# Altium project ControllerBoard.PrjPcb
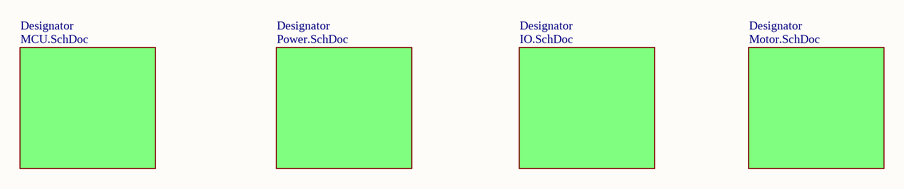
[diagram p0: main.SchDoc]
5 sheets, 155 parts. Net scope: global (net labels, ports and power ports of the same name join across sheets).
Board file: ControllerBoard.PcbDoc
Sheets:
  main.SchDoc
    Designator = MCU.SchDoc
    Designator = Power.SchDoc
    Designator = IO.SchDoc
    Designator = Motor.SchDoc

## Sheet main.SchDoc
size A4

### Sub-sheets
Designator = MCU.SchDoc: no entries
Designator = Power.SchDoc: no entries
Designator = IO.SchDoc: no entries
Designator = Motor.SchDoc: no entries

## Sheet MCU.SchDoc
size A4
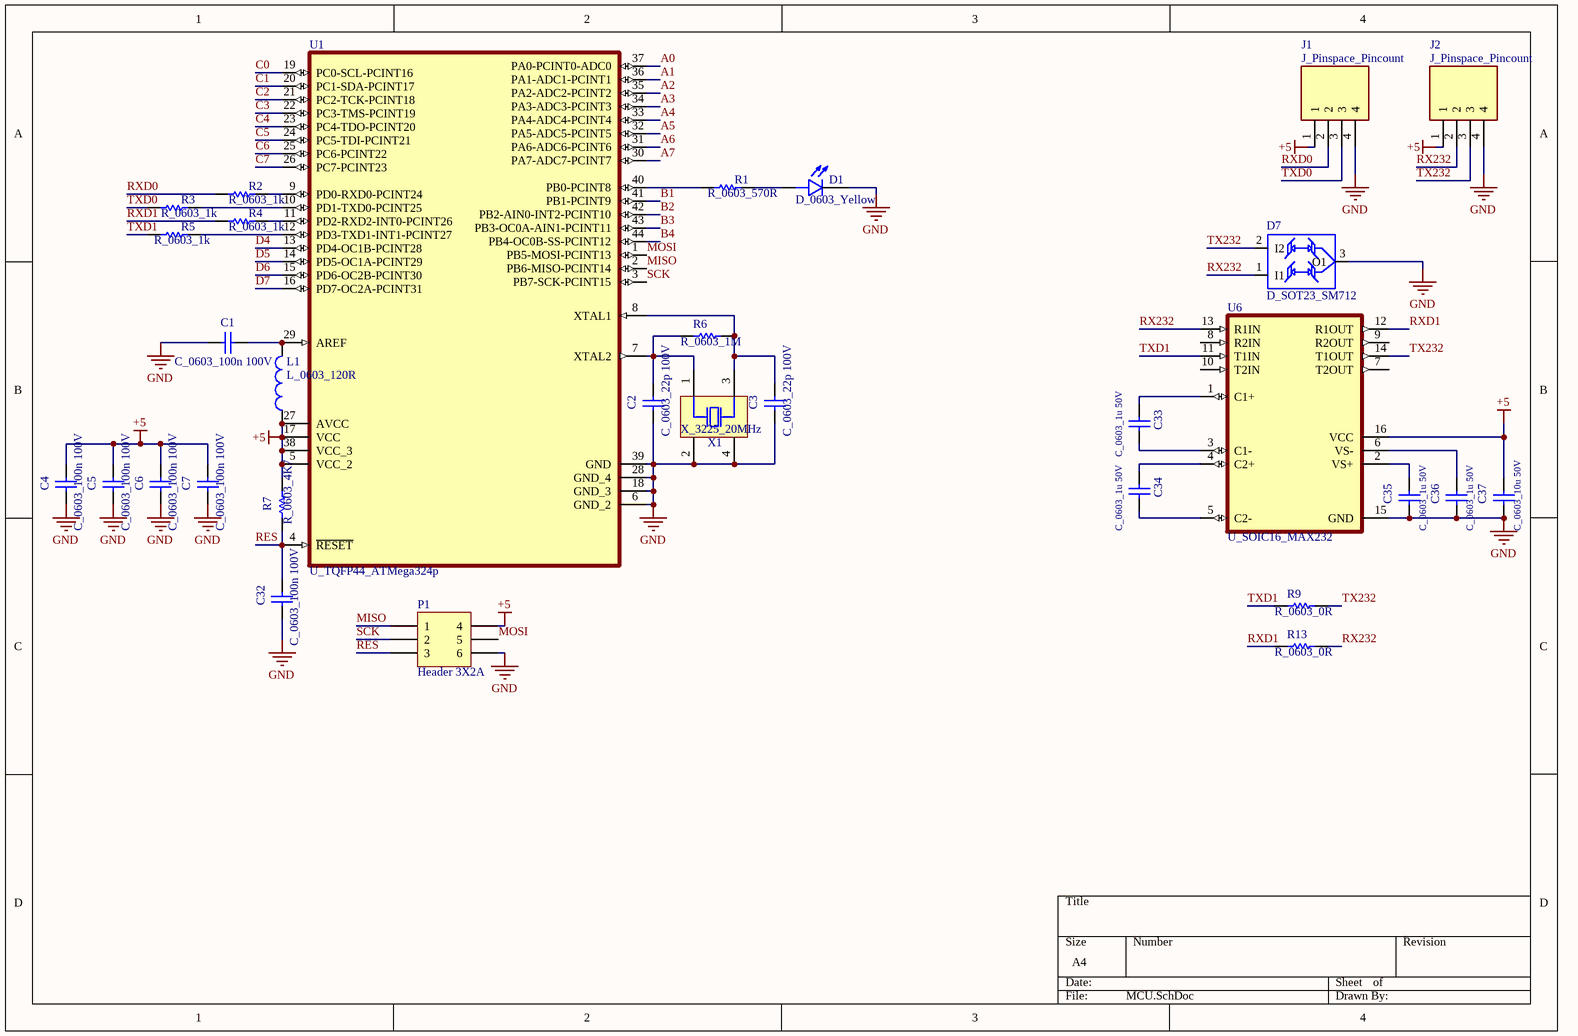
[diagram p1: MCU.SchDoc]

### Parts
C1  C_0603_100n 100V  [CAP 0603]
C2  C_0603_22p 100V  [CAP 0603]
C3  C_0603_22p 100V  [CAP 0603]
C4  C_0603_100n 100V  [CAP 0603]
C5  C_0603_100n 100V  [CAP 0603]
C6  C_0603_100n 100V  [CAP 0603]
C7  C_0603_100n 100V  [CAP 0603]
C32  C_0603_100n 100V  [CAP 0603]
C33  C_0603_1u 50V  [CAP 0603]
C34  C_0603_1u 50V  [CAP 0603]
C35  C_0603_1u 50V  [CAP 0603]
C36  C_0603_1u 50V  [CAP 0603]
C37  C_0603_10u 50V  [CAP 0603]
D1  D_0603_Yellow  [Led 0603]
D7  D_SOT23_SM712  [SOT23]
J1  J_Pinspace_Pincount  [4 Pin PCB STB 5.08]
J2  J_Pinspace_Pincount  [4 Pin PCB STB 5.08]
L1  L_0603_120R  [Inductor 0603]
P1  Header 3X2A  [HDR2X3_CEN]
R1  R_0603_570R  [RES 0603]
R2  R_0603_1k  [RES 0603]
R3  R_0603_1k  [RES 0603]
R4  R_0603_1k  [RES 0603]
R5  R_0603_1k  [RES 0603]
R6  R_0603_1M  [RES 0603]
R7  R_0603_4K7  [RES 0603]
R9  R_0603_0R  [RES 0603]
R13  R_0603_0R  [RES 0603]
U1  U_TQFP44_ATMega324p  [TQFP44]
U6  U_SOIC16_MAX232  [SOIC16]
X1  X_3225_20MHz  [Crystal 3.2x2.5]

### Nets
+5: C4.2 C5.2 C6.2 C7.2 C37.2 J1.1 J2.1 L1.1 P1.4 R7.2 U1.5(VCC_2) U1.17(VCC) U1.27(AVCC) U1.38(VCC_3) U6.16(VCC)
GND: C1.1 C2.2 C3.2 C4.1 C5.1 C6.1 C7.1 C32.1 C35.1 C36.1 C37.1 D1.2(C) D7.3(O1) J1.4 J2.4 P1.6 U1.6(GND_2) U1.18(GND_3) U1.28(GND_4) U1.39(GND) U6.15(GND) X1.2(NC) X1.4(NC)
A0: U1.37(PA0-PCINT0-ADC0)
A1: U1.36(PA1-ADC1-PCINT1)
A2: U1.35(PA2-ADC2-PCINT2)
A3: U1.34(PA3-ADC3-PCINT3)
A4: U1.33(PA4-ADC4-PCINT4)
A5: U1.32(PA5-ADC5-PCINT5)
A6: U1.31(PA6-ADC6-PCINT6)
A7: U1.30(PA7-ADC7-PCINT7)
B1: U1.41(PB1-PCINT9)
B2: U1.42(PB2-AIN0-INT2-PCINT10)
B3: U1.43(PB3-OC0A-AIN1-PCINT11)
B4: U1.44(PB4-OC0B-SS-PCINT12)
C0: U1.19(PC0-SCL-PCINT16)
C1: U1.20(PC1-SDA-PCINT17)
C2: U1.21(PC2-TCK-PCINT18)
C3: U1.22(PC3-TMS-PCINT19)
C4: U1.23(PC4-TDO-PCINT20)
C5: U1.24(PC5-TDI-PCINT21)
C6: U1.25(PC6-PCINT22)
C7: U1.26(PC7-PCINT23)
D4: U1.13(PD4-OC1B-PCINT28)
D5: U1.14(PD5-OC1A-PCINT29)
D6: U1.15(PD6-OC2B-PCINT30)
D7: U1.16(PD7-OC2A-PCINT31)
MISO: P1.1 U1.2(PB6-MISO-PCINT14)
MOSI: P1.5 U1.1(PB5-MOSI-PCINT13)
RES: C32.2 P1.3 R7.1 U1.4(~{RESET})
RX232: D7.1(I1) J2.2 R13.2 U6.13(R1IN)
RXD0: J1.2 R2.2
RXD1: R4.2 R13.1 U6.12(R1OUT)
SCK: P1.2 U1.3(PB7-SCK-PCINT15)
TX232: D7.2(I2) J2.3 R9.2 U6.14(T1OUT)
TXD0: J1.3 R3.2
TXD1: R5.2 R9.1 U6.11(T1IN)
NetC1_2: C1.2 L1.2 U1.29(AREF)
NetC2_1: C2.1 R6.1 U1.7(XTAL2) X1.1(OSC1)
NetC3_1: C3.1 R6.2 U1.8(XTAL1) X1.3(OSC2)
NetC33_1: C33.1 U6.1(C1+)
NetC33_2: C33.2 U6.3(C1-)
NetC34_1: C34.1 U6.4(C2+)
NetC34_2: C34.2 U6.5(C2-)
NetC35_2: C35.2 U6.2(VS+)
NetC36_2: C36.2 U6.6(VS-)
NetD1_1: D1.1(A) R1.1
NetR1_2: R1.2 U1.40(PB0-PCINT8)
NetR2_1: R2.1 U1.9(PD0-RXD0-PCINT24)
NetR3_1: R3.1 U1.10(PD1-TXD0-PCINT25)
NetR4_1: R4.1 U1.11(PD2-RXD2-INT0-PCINT26)
NetR5_1: R5.1 U1.12(PD3-TXD1-INT1-PCINT27)

Not connected (* = marked no-connect by the designer): U6 7(T2OUT) 8(R2IN) 9(R2OUT) 10(T2IN)

### Library data of the parts
C1-C7 C32-C37 = Cap: Capacitor; Published: 8-Jun-2000; LatestRevisionDate: 17-Jul-2002; LatestRevisionNote: Re-released for DXP Platform.; Publisher: Altium Limited
D1 = Led: MP: SML-D12FWT86; MF: Rohm; Price: None; Availability: In Stock; Package: 0603 Rohm; SnapEDA_Link: https://www.snapeda.com/parts/SML-D12FWT86/Rohm/view-part/?ref=snap; Check_prices: https://www.snapeda.com/parts/SML-D12FWT86/Rohm/view-part/?ref=eda; Value: *; Purchase-URL: https://pricing.snapeda.com/search/part/SML-D12FWT86/?ref=eda
D7 = DIODE TVS ARRAY: TVS Diode Array; MP: SM712; MF: Semtech; Price: None; SnapEDA_Link: https://www.snapeda.com/parts/SM712/Semtech/view-part/4219095/?ref=snap; Availability: Unavailable; Value: *; Package: SOT-23 Semtech
J1 J2 = 4 Pin PCB Terminal Block: MP: TBP02R1-381-04BE; Availability: Unavailable; Package: None; Price: None; Value: *
L1 = Inductor: PCB_Layout: Complies with manufacturer's recommendation.; Published: 26-Sep-2008; DatasheetVersion: Mar-2008; PackageVersion: Mar-2008; PackageReference: B82462G4; Publisher: Altium Limited; PackageDescription: SM Power Inductor; 2 Leads; Body 6.3 x 6.3 x 3.0 mm (LxWxH); ComponentLink1Description: Manufacturer Link; ComponentLink1URL: http://www.epcos.com/; ComponentLink2Description: Datasheet; ComponentLink2URL: http://www.epcos.com/inf/30/db/ind_2008/b82462g4.pdf
P1 = Header 3X2A: Header, 3-Pin, Dual row; LatestRevisionDate: 17-Jul-2002; LatestRevisionNote: Re-released for DXP Platform.; Publisher: Altium Limited
R1-R7 R9 R13 = Res: Resistor; Published: 8-Jun-2000; LatestRevisionDate: 17-Jul-2002; LatestRevisionNote: Re-released for DXP Platform.; Publisher: Altium Limited
U1 = ATMEGA324P-20AU: AVR AVRÂ® ATmega Microcontroller IC 8-Bit 20MHz 32KB _16K x 16_ FLASH 44-TQFP _10x10_; MF: Microchip; Availability: Unavailable; Package: TQFP-44 Microchip; Price: None; SnapEDA_Link: https://www.snapeda.com/parts/ATMEGA324P-20AU/Microchip/view-part/696895/?ref=snap; Value: *; MP: ATMEGA324P-20AU
U6 = MAX232DW: Dual EIA-232 driver and receiver 16-SOIC 0 to 70; MF: Texas Instruments; Price: None; SnapEDA_Link: https://www.snapeda.com/parts/MAX232DW/Texas%20Instruments/view-part/7702/?ref=snap; Purchase-URL: https://pricing.snapeda.com/search/part/MAX232DW/?ref=eda; Check_prices: https://www.snapeda.com/parts/MAX232DW/Texas%20Instruments/view-part/7702/?ref=eda; Value: *; MP: MAX232DW; Package: SOIC-16 Texas Instruments; Availability: Good
X1 = Crystal 4 Pin

## Sheet Power.SchDoc
size A4
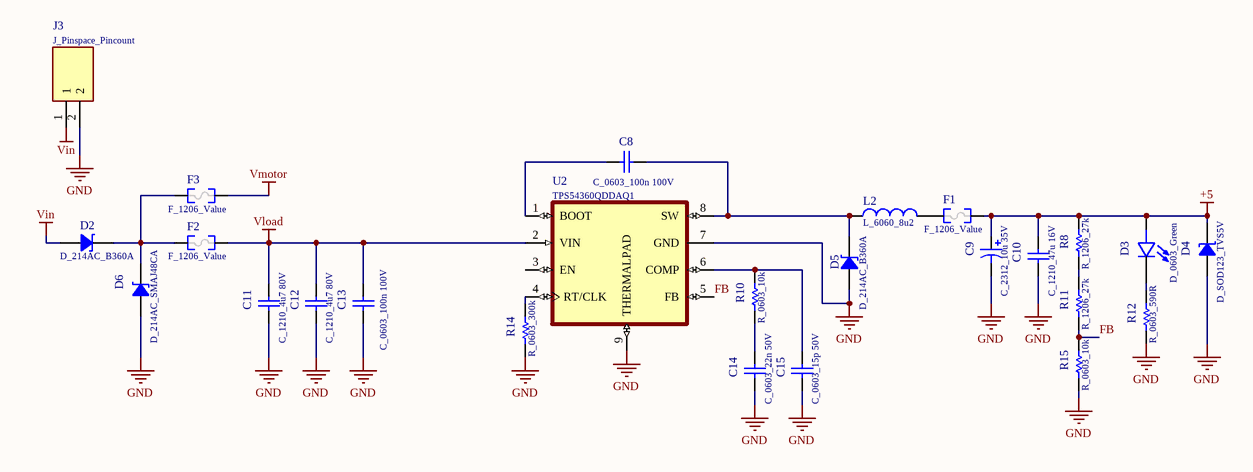
[diagram p2: Power.SchDoc]

### Parts
C8  C_0603_100n 100V  [CAP 0603]
C9  C_2312_10u 35V  [CAP 2312 TAN]
C10  C_1210_47u 16V  [CAP 1210]
C11  C_1210_4u7 80V  [CAP 1210]
C12  C_1210_4u7 80V  [CAP 1210]
C13  C_0603_100n 100V  [CAP 0603]
C14  C_0603_22n 50V  [CAP 0603]
C15  C_0603_15p 50V  [CAP 0603]
D2  D_214AC_B360A  [DO214AC SMA]
D3  D_0603_Green  [Led 0603]
D4  D_SOD123_TVS5V  [SOD-123]
D5  D_214AC_B360A  [DO214AC SMA]
D6  D_214AC_SMAJ48CA  [DO214AC SMA]
F1  F_1206_Value  [FUSE 1206_3216 0.6MM]
F2  F_1206_Value  [FUSE 1206_3216 0.6MM]
F3  F_1206_Value  [FUSE 1206_3216 0.6MM]
J3  J_Pinspace_Pincount  [2 Pin PCB STB 5.08]
L2  L_6060_8u2  [Inductor 6060]
R8  R_1206_27k  [RES 1206]
R10  R_0603_10k  [RES 0603]
R11  R_1206_27k  [RES 1206]
R12  R_0603_590R  [RES 0603]
R14  R_0603_300k  [RES 0603]
R15  R_0603_10k  [RES 1206]
U2  TPS54360QDDAQ1  [SOIC8]

### Nets
+5: C9.1 C10.1 D3.1(A) D4.2 F1.2 R8.2
GND: C9.2 C10.2 C11.2 C12.2 C13.2 C14.2 C15.2 D4.1 D5.1 D6.1 J3.2 R12.1 R14.1 R15.1 U2.7(GND) U2.9(THERMALPAD)
Vin: D2.1 J3.1
Vload: C11.1 C12.1 C13.1 F2.2 U2.2(VIN)
Vmotor: F3.2
FB: R11.1 R15.2 U2.5(FB)
NetC8_1: C8.1 D5.2 L2.1 U2.8(SW)
NetC8_2: C8.2 U2.1(BOOT)
NetC14_1: C14.1 R10.1
NetC15_1: C15.1 R10.2 U2.6(COMP)
NetD2_2: D2.2 D6.2 F2.1 F3.1
NetD3_2: D3.2(C) R12.2
NetF1_1: F1.1 L2.2
NetR8_1: R8.1 R11.2
NetR14_2: R14.2 U2.4(RT/CLK)

Not connected (* = marked no-connect by the designer): U2 3(EN)

### Library data of the parts
C8 C10-C15 = Cap: Capacitor; Published: 8-Jun-2000; LatestRevisionDate: 17-Jul-2002; LatestRevisionNote: Re-released for DXP Platform.; Publisher: Altium Limited
C9 = Cap Tantalium: Capacitor Tantalium; Published: 8-Jun-2000; LatestRevisionDate: 17-Jul-2002; LatestRevisionNote: Re-released for DXP Platform.; Publisher: Altium Limited
D2 D5 D6 = Diode Zener: Zener Diode
D3 = Led: MP: SML-D12FWT86; MF: Rohm; Price: None; Availability: In Stock; Package: 0603 Rohm; SnapEDA_Link: https://www.snapeda.com/parts/SML-D12FWT86/Rohm/view-part/?ref=snap; Check_prices: https://www.snapeda.com/parts/SML-D12FWT86/Rohm/view-part/?ref=eda; Value: *; Purchase-URL: https://pricing.snapeda.com/search/part/SML-D12FWT86/?ref=eda
D4 = DIODE TVS UNI: Rectifier Diode
F1-F3 = Fuse
J3 = 2 Pin PCB Terminal Block: MF: CUI Devices; MP: TBP02R1-381-02BE; CUI_purchase_URL: https://www.cuidevices.com/product/interconnect/connectors/terminal-blocks/tbp02r1-381-series?utm_source=snapeda.com&utm_medium=referral&utm_campaign=snapedaBOM; Purchase-URL: https://pricing.snapeda.com/search/part/TBP02R1-381-02BE/?ref=eda; Price: None; SnapEDA_Link: https://www.snapeda.com/parts/TBP02R1-381-02BE/CUI+Devices/view-part/?ref=snap; Check_prices: https://www.snapeda.com/parts/TBP02R1-381-02BE/CUI+Devices/view-part/?ref=eda; Package: None; Availability: In Stock; Value: *
L2 = Inductor: as L1 on sheet MCU; Published: 26-Sep-2008; DatasheetVersion: Mar-2008; PackageVersion: Mar-2008; PackageReference: B82462G4; Publisher: Altium Limited; PackageDescription: SM Power Inductor; 2 Leads; Body 6.3 x 6.3 x 3.0 mm (LxWxH); ComponentLink1Description: Manufacturer Link; ComponentLink1URL: http://www.epcos.com/; ComponentLink2Description: Datasheet; ComponentLink2URL: http://www.epcos.com/inf/30/db/ind_2008/b82462g4.pdf
R8 R10-R12 R14 R15 = Res: Resistor; Published: 8-Jun-2000; LatestRevisionDate: 17-Jul-2002; LatestRevisionNote: Re-released for DXP Platform.; Publisher: Altium Limited
U2 = TPS54360QDDAQ1: Package: None; Price: None; Value: *; MP: TPS54360QDDAQ1; Availability: Unavailable

## Sheet IO.SchDoc
size A3
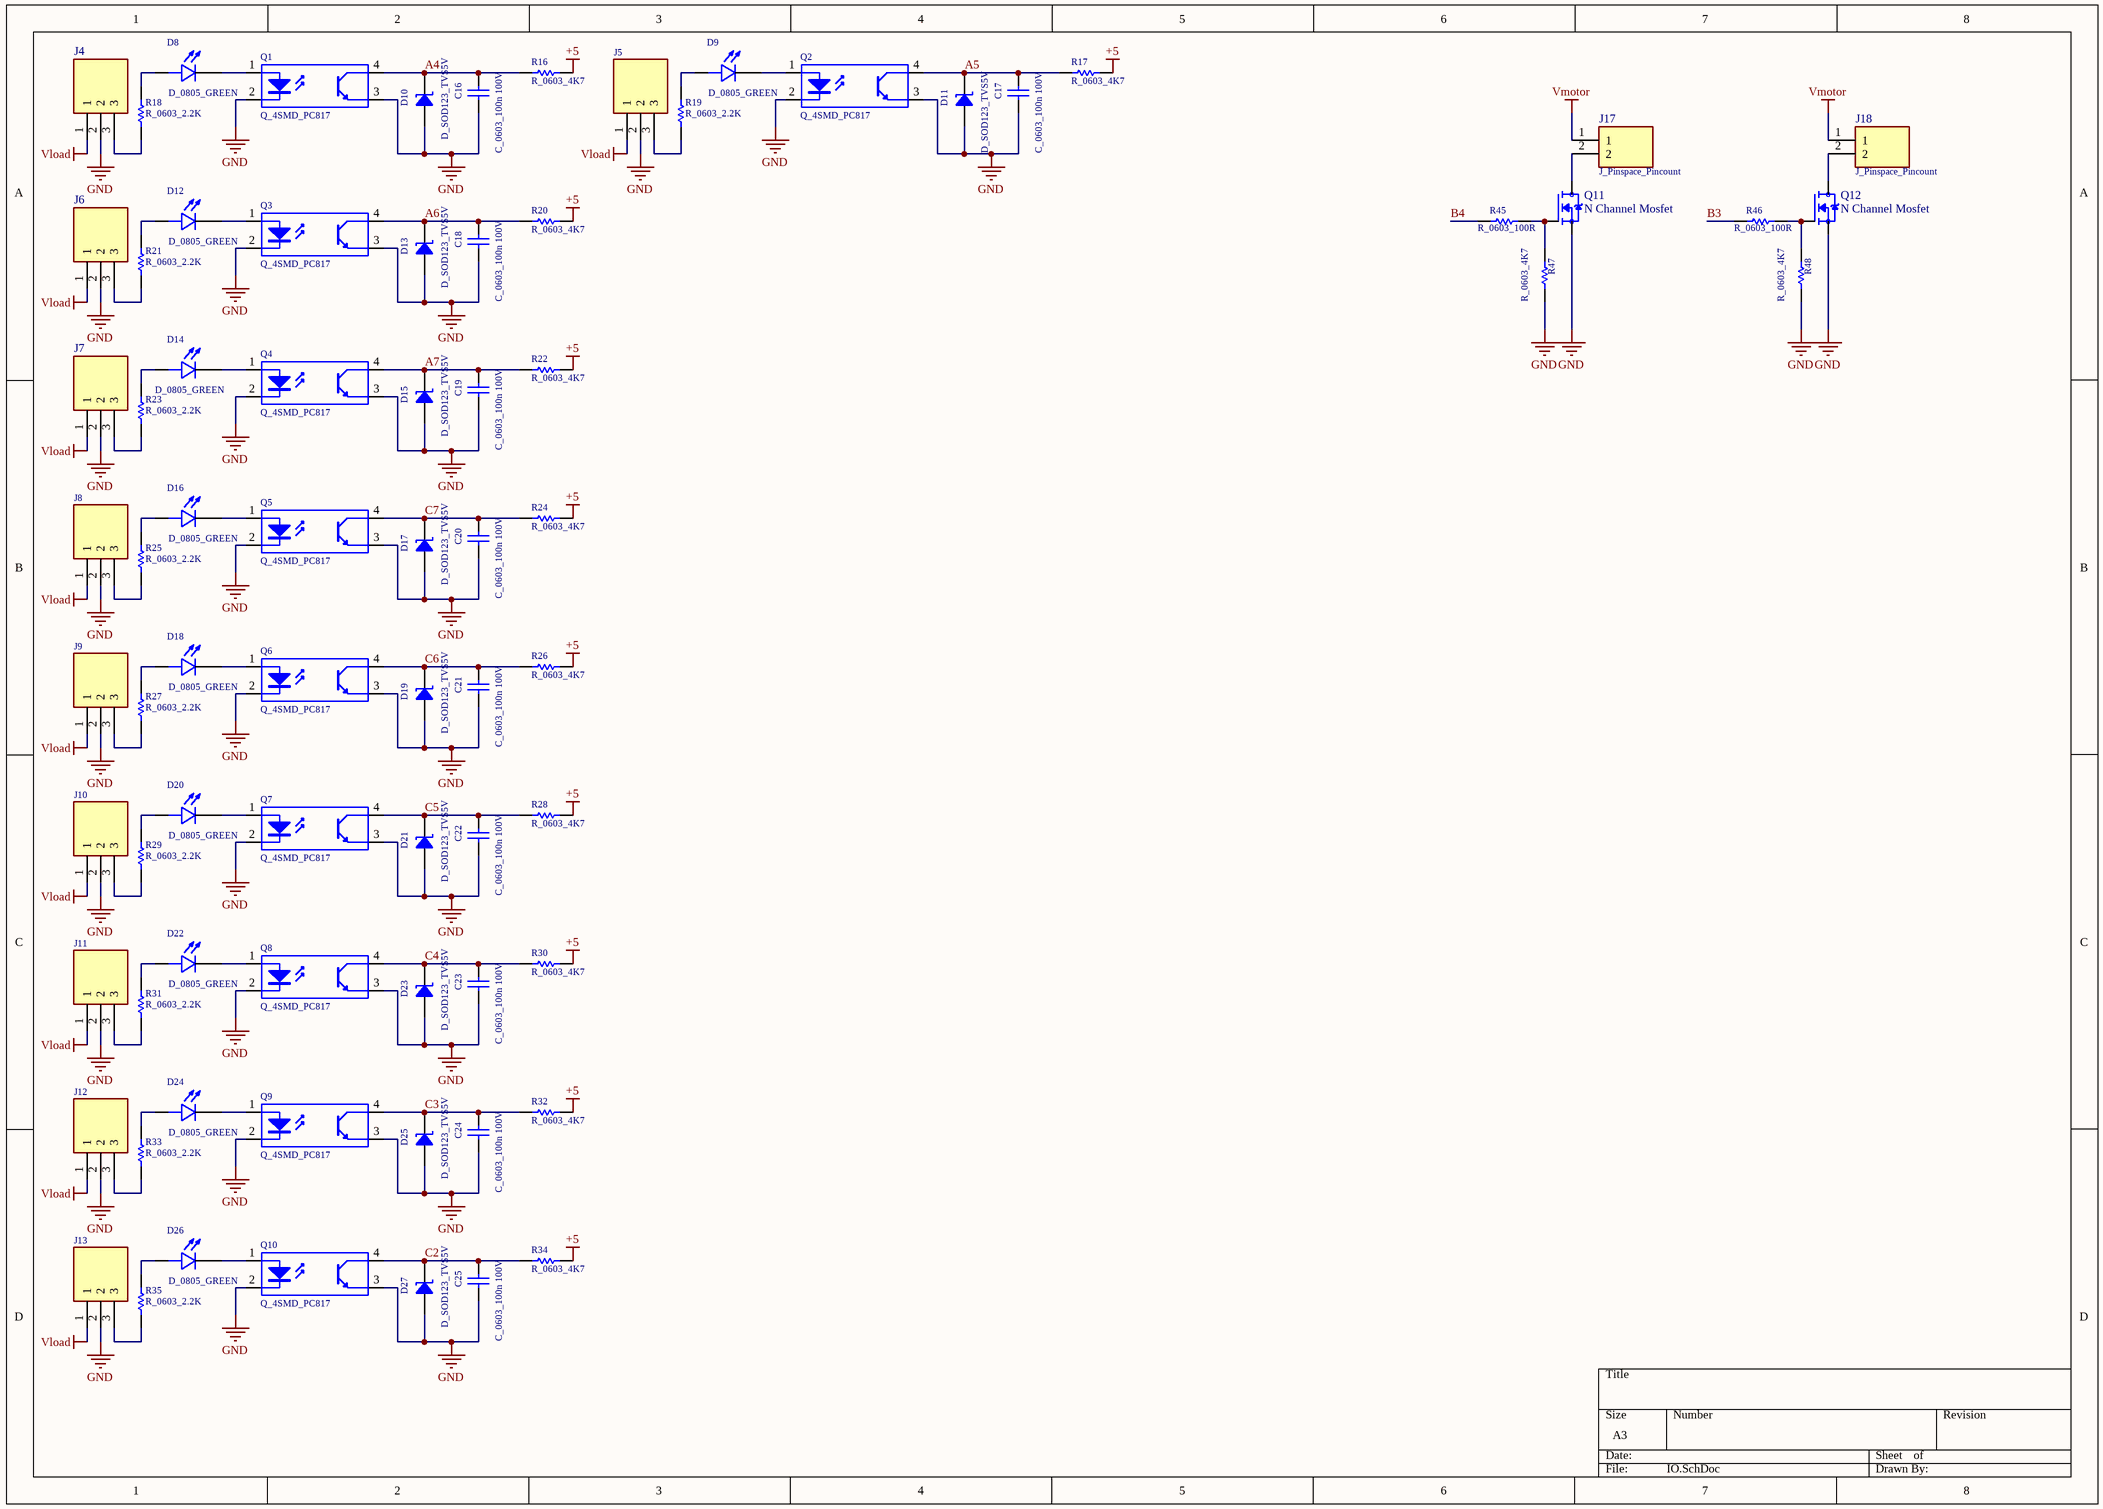
[diagram p3: IO.SchDoc]

### Parts
C16  C_0603_100n 100V  [CAP 1206]
C17  C_0603_100n 100V  [CAP 1206]
C18  C_0603_100n 100V  [CAP 1206]
C19  C_0603_100n 100V  [CAP 1206]
C20  C_0603_100n 100V  [CAP 1206]
C21  C_0603_100n 100V  [CAP 1206]
C22  C_0603_100n 100V  [CAP 1206]
C23  C_0603_100n 100V  [CAP 1206]
C24  C_0603_100n 100V  [CAP 1206]
C25  C_0603_100n 100V  [CAP 1206]
D8  D_0805_GREEN  [Led 0603]
D9  D_0805_GREEN  [Led 0603]
D10  D_SOD123_TVS5V  [SOD-123]
D11  D_SOD123_TVS5V  [SOD-123]
D12  D_0805_GREEN  [Led 0603]
D13  D_SOD123_TVS5V  [SOD-123]
D14  D_0805_GREEN  [Led 0603]
D15  D_SOD123_TVS5V  [SOD-123]
D16  D_0805_GREEN  [Led 0603]
D17  D_SOD123_TVS5V  [SOD-123]
D18  D_0805_GREEN  [Led 0603]
D19  D_SOD123_TVS5V  [SOD-123]
D20  D_0805_GREEN  [Led 0603]
D21  D_SOD123_TVS5V  [SOD-123]
D22  D_0805_GREEN  [Led 0603]
D23  D_SOD123_TVS5V  [SOD-123]
D24  D_0805_GREEN  [Led 0603]
D25  D_SOD123_TVS5V  [SOD-123]
D26  D_0805_GREEN  [Led 0603]
D27  D_SOD123_TVS5V  [SOD-123]
J4  J_Pinspace_Pincount  [3 Pin PCB STB 5.08]  (value not drawn)
J5  J_Pinspace_Pincount  [3 Pin PCB STB 5.08]  (value not drawn)
J6  J_Pinspace_Pincount  [3 Pin PCB STB 5.08]  (value not drawn)
J7  J_Pinspace_Pincount  [3 Pin PCB STB 5.08]  (value not drawn)
J8  J_Pinspace_Pincount  [3 Pin PCB STB 5.08]  (value not drawn)
J9  J_Pinspace_Pincount  [3 Pin PCB STB 5.08]  (value not drawn)
J10  J_Pinspace_Pincount  [3 Pin PCB STB 5.08]  (value not drawn)
J11  J_Pinspace_Pincount  [3 Pin PCB STB 5.08]  (value not drawn)
J12  J_Pinspace_Pincount  [3 Pin PCB STB 5.08]  (value not drawn)
J13  J_Pinspace_Pincount  [3 Pin PCB STB 5.08]  (value not drawn)
J17  J_Pinspace_Pincount  [2 Pin PCB STB 5.08]
J18  J_Pinspace_Pincount  [2 Pin PCB STB 5.08]
Q1  Q_4SMD_PC817  [4-SMD]
Q2  Q_4SMD_PC817  [4-SMD]
Q3  Q_4SMD_PC817  [4-SMD]
Q4  Q_4SMD_PC817  [4-SMD]
Q5  Q_4SMD_PC817  [4-SMD]
Q6  Q_4SMD_PC817  [4-SMD]
Q7  Q_4SMD_PC817  [4-SMD]
Q8  Q_4SMD_PC817  [4-SMD]
Q9  Q_4SMD_PC817  [4-SMD]
Q10  Q_4SMD_PC817  [4-SMD]
Q11  N Channel Mosfet  [TO-252]
Q12  N Channel Mosfet  [TO-252]
R16  R_0603_4K7  [RES 1206]
R17  R_0603_4K7  [RES 1206]
R18  R_0603_2.2K  [RES 1206]
R19  R_0603_2.2K  [RES 1206]
R20  R_0603_4K7  [RES 1206]
R21  R_0603_2.2K  [RES 1206]
R22  R_0603_4K7  [RES 1206]
R23  R_0603_2.2K  [RES 1206]
R24  R_0603_4K7  [RES 1206]
R25  R_0603_2.2K  [RES 1206]
R26  R_0603_4K7  [RES 1206]
R27  R_0603_2.2K  [RES 1206]
R28  R_0603_4K7  [RES 1206]
R29  R_0603_2.2K  [RES 1206]
R30  R_0603_4K7  [RES 1206]
R31  R_0603_2.2K  [RES 1206]
R32  R_0603_4K7  [RES 1206]
R33  R_0603_2.2K  [RES 1206]
R34  R_0603_4K7  [RES 1206]
R35  R_0603_2.2K  [RES 1206]
R45  R_0603_100R  [RES 1206]
R46  R_0603_100R  [RES 1206]
R47  R_0603_4K7  [RES 1206]
R48  R_0603_4K7  [RES 1206]

### Nets
+5: R16.1 R17.1 R20.1 R22.1 R24.1 R26.1 R28.1 R30.1 R32.1 R34.1
GND: C16.2 C17.2 C18.2 C19.2 C20.2 C21.2 C22.2 C23.2 C24.2 C25.2 D10.1 D11.1 D13.1 D15.1 D17.1 D19.1 D21.1 D23.1 D25.1 D27.1 J4.2 J5.2 J6.2 J7.2 J8.2 J9.2 J10.2 J11.2 J12.2 J13.2 Q1.2(K) Q1.3(E) Q2.2(K) Q2.3(E) Q3.2(K) Q3.3(E) Q4.2(K) Q4.3(E) Q5.2(K) Q5.3(E) Q6.2(K) Q6.3(E) Q7.2(K) Q7.3(E) Q8.2(K) Q8.3(E) Q9.2(K) Q9.3(E) Q10.2(K) Q10.3(E) Q11.3(S) Q12.3(S) R47.2 R48.2
Vload: J4.1 J5.1 J6.1 J7.1 J8.1 J9.1 J10.1 J11.1 J12.1 J13.1
Vmotor: J17.1 J18.1
A4: C16.1 D10.2 Q1.4(C) R16.2
A5: C17.1 D11.2 Q2.4(C) R17.2
A6: C18.1 D13.2 Q3.4(C) R20.2
A7: C19.1 D15.2 Q4.4(C) R22.2
B3: R46.2
B4: R45.2
C2: C25.1 D27.2 Q10.4(C) R34.2
C3: C24.1 D25.2 Q9.4(C) R32.2
C4: C23.1 D23.2 Q8.4(C) R30.2
C5: C22.1 D21.2 Q7.4(C) R28.2
C6: C21.1 D19.2 Q6.4(C) R26.2
C7: C20.1 D17.2 Q5.4(C) R24.2
NetD8_1: D8.1(A) R18.2
NetD8_2: D8.2(C) Q1.1(A)
NetD9_1: D9.1(A) R19.2
NetD9_2: D9.2(C) Q2.1(A)
NetD12_1: D12.1(A) R21.2
NetD12_2: D12.2(C) Q3.1(A)
NetD14_1: D14.1(A) R23.2
NetD14_2: D14.2(C) Q4.1(A)
NetD16_1: D16.1(A) R25.2
NetD16_2: D16.2(C) Q5.1(A)
NetD18_1: D18.1(A) R27.2
NetD18_2: D18.2(C) Q6.1(A)
NetD20_1: D20.1(A) R29.2
NetD20_2: D20.2(C) Q7.1(A)
NetD22_1: D22.1(A) R31.2
NetD22_2: D22.2(C) Q8.1(A)
NetD24_1: D24.1(A) R33.2
NetD24_2: D24.2(C) Q9.1(A)
NetD26_1: D26.1(A) R35.2
NetD26_2: D26.2(C) Q10.1(A)
NetJ4_3: J4.3 R18.1
NetJ5_3: J5.3 R19.1
NetJ6_3: J6.3 R21.1
NetJ7_3: J7.3 R23.1
NetJ8_3: J8.3 R25.1
NetJ9_3: J9.3 R27.1
NetJ10_3: J10.3 R29.1
NetJ11_3: J11.3 R31.1
NetJ12_3: J12.3 R33.1
NetJ13_3: J13.3 R35.1
NetJ17_2: J17.2 Q11.4(D)
NetJ18_2: J18.2 Q12.4(D)
NetQ11_1: Q11.1(G) R45.1 R47.1
NetQ12_1: Q12.1(G) R46.1 R48.1

### Library data of the parts
C16-C25 = Cap: Capacitor; Published: 8-Jun-2000; LatestRevisionDate: 17-Jul-2002; LatestRevisionNote: Re-released for DXP Platform.; Publisher: Altium Limited
D8 D9 D12 D14 D16 D18 D20 D22 D24 D26 = Led: MP: SML-D12FWT86; MF: Rohm; Price: None; Availability: In Stock; Package: 0603 Rohm; SnapEDA_Link: https://www.snapeda.com/parts/SML-D12FWT86/Rohm/view-part/?ref=snap; Check_prices: https://www.snapeda.com/parts/SML-D12FWT86/Rohm/view-part/?ref=eda; Value: *; Purchase-URL: https://pricing.snapeda.com/search/part/SML-D12FWT86/?ref=eda
D10 D11 D13 D15 D17 D19 D21 D23 D25 D27 = DIODE TVS UNI: Rectifier Diode
J4-J13 = 3 Pin PCB Terminal Block: MF: {'manufacturer': u'CUI'}; MP: TBP02R1-381-03BE; Price: None; Package: None; Value: *; Availability: Unavailable
J17 J18 = 2 Pin PCB Terminal Block: MF: CUI Devices; MP: TBP02R1-381-02BE; CUI_purchase_URL: https://www.cuidevices.com/product/interconnect/connectors/terminal-blocks/tbp02r1-381-series?utm_source=snapeda.com&utm_medium=referral&utm_campaign=snapedaBOM; Purchase-URL: https://pricing.snapeda.com/search/part/TBP02R1-381-02BE/?ref=eda; Price: None; SnapEDA_Link: https://www.snapeda.com/parts/TBP02R1-381-02BE/CUI+Devices/view-part/?ref=snap; Check_prices: https://www.snapeda.com/parts/TBP02R1-381-02BE/CUI+Devices/view-part/?ref=eda; Package: None; Availability: In Stock; Value: *
Q1-Q10 = Opto Coupler: Opto-Coupler
Q11 Q12 = N Channel Mosfet: RoHS Compliant | Low RDS(on) | Industry-leading quality | Dynamic dv/dt Rating | Fast Switching | Fully Avalanche Rated | 175C Operating Temperature | Logic Level; MP: IRLR2705PBF; MF: Infineon Technologies; Check_prices: https://www.snapeda.com/parts/IRLR2705PBF/Infineon+Technologies/view-part/?ref=eda; Value: *; Availability: In Stock; Price: None; Package: TO-252 Infineon; SnapEDA_Link: https://www.snapeda.com/parts/IRLR2705PBF/Infineon+Technologies/view-part/?ref=snap; Purchase-URL: https://pricing.snapeda.com/search/part/IRLR2705PBF/?ref=eda
R16-R35 R45-R48 = Res: Resistor; Published: 8-Jun-2000; LatestRevisionDate: 17-Jul-2002; LatestRevisionNote: Re-released for DXP Platform.; Publisher: Altium Limited

## Sheet Motor.SchDoc
size A3
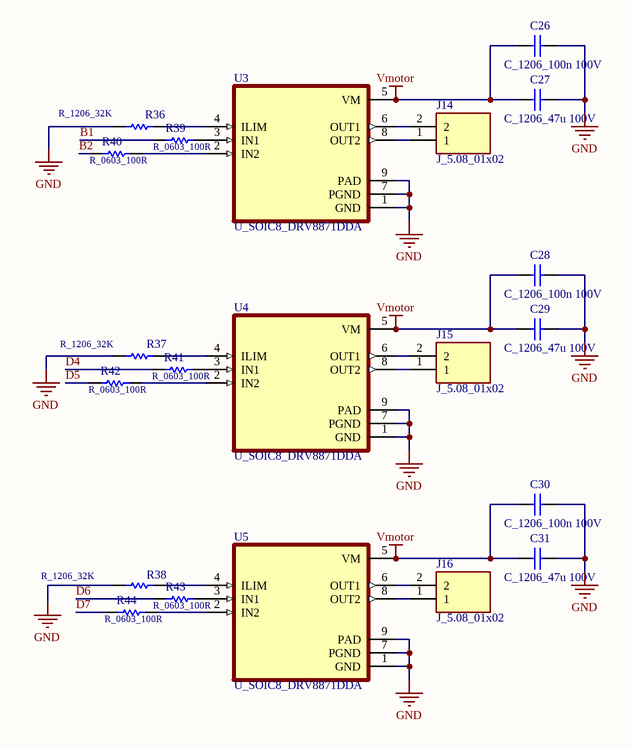
[diagram p4: Motor.SchDoc]

### Parts
C26  C_1206_100n 100V  [CAP 1206]
C27  C_1206_47u 100V  [CAP 1206]
C28  C_1206_100n 100V  [CAP 1206]
C29  C_1206_47u 100V  [CAP 1206]
C30  C_1206_100n 100V  [CAP 1206]
C31  C_1206_47u 100V  [CAP 1206]
J14  J_5.08_01x02  [2 Pin PCB STB 5.08]
J15  J_5.08_01x02  [2 Pin PCB STB 5.08]
J16  J_5.08_01x02  [2 Pin PCB STB 5.08]
R36  R_1206_32K  [RES 1206]
R37  R_1206_32K  [RES 1206]
R38  R_1206_32K  [RES 1206]
R39  R_0603_100R  [RES 1206]
R40  R_0603_100R  [RES 1206]
R41  R_0603_100R  [RES 1206]
R42  R_0603_100R  [RES 1206]
R43  R_0603_100R  [RES 1206]
R44  R_0603_100R  [RES 1206]
U3  U_SOIC8_DRV8871DDA  [SOIC8]
U4  U_SOIC8_DRV8871DDA  [SOIC8]
U5  U_SOIC8_DRV8871DDA  [SOIC8]

### Nets
GND: C26.2 C27.2 C28.2 C29.2 C30.2 C31.2 R36.1 R37.1 R38.1 U3.1(GND) U3.7(PGND) U3.9(PAD) U4.1(GND) U4.7(PGND) U4.9(PAD) U5.1(GND) U5.7(PGND) U5.9(PAD)
Vmotor: C26.1 C27.1 C28.1 C29.1 C30.1 C31.1 U3.5(VM) U4.5(VM) U5.5(VM)
B1: R39.1
B2: R40.1
D4: R41.1
D5: R42.1
D6: R43.1
D7: R44.1
NetJ14_1: J14.1 U3.8(OUT2)
NetJ14_2: J14.2 U3.6(OUT1)
NetJ15_1: J15.1 U4.8(OUT2)
NetJ15_2: J15.2 U4.6(OUT1)
NetJ16_1: J16.1 U5.8(OUT2)
NetJ16_2: J16.2 U5.6(OUT1)
NetR36_2: R36.2 U3.4(ILIM)
NetR37_2: R37.2 U4.4(ILIM)
NetR38_2: R38.2 U5.4(ILIM)
NetR39_2: R39.2 U3.3(IN1)
NetR40_2: R40.2 U3.2(IN2)
NetR41_2: R41.2 U4.3(IN1)
NetR42_2: R42.2 U4.2(IN2)
NetR43_2: R43.2 U5.3(IN1)
NetR44_2: R44.2 U5.2(IN2)

### Library data of the parts
C26-C31 = Cap: Capacitor; Published: 8-Jun-2000; LatestRevisionDate: 17-Jul-2002; LatestRevisionNote: Re-released for DXP Platform.; Publisher: Altium Limited
J14-J16 = 2 Pin PCB Terminal Block: MF: CUI Devices; MP: TBP02R1-381-02BE; CUI_purchase_URL: https://www.cuidevices.com/product/interconnect/connectors/terminal-blocks/tbp02r1-381-series?utm_source=snapeda.com&utm_medium=referral&utm_campaign=snapedaBOM; Purchase-URL: https://pricing.snapeda.com/search/part/TBP02R1-381-02BE/?ref=eda; Price: None; SnapEDA_Link: https://www.snapeda.com/parts/TBP02R1-381-02BE/CUI+Devices/view-part/?ref=snap; Check_prices: https://www.snapeda.com/parts/TBP02R1-381-02BE/CUI+Devices/view-part/?ref=eda; Package: None; Availability: In Stock; Value: *
R36-R44 = Res: Resistor; Published: 8-Jun-2000; LatestRevisionDate: 17-Jul-2002; LatestRevisionNote: Re-released for DXP Platform.; Publisher: Altium Limited
U3-U5 = DRV8871DDA: 45-V, 3.6-A H-bridge motor driver with integrated current sensing 8-SO PowerPAD -40 to 125; MF: Texas Instruments; Mouser-Purchase-URL: https://snapeda.com/shop?store=Mouser&id=547750; SnapEDA_Link: https://www.snapeda.com/parts/DRV8871DDA/Texas%20Instruments/view-part/547750/?ref=snap; DigiKey-Purchase-URL: https://snapeda.com/shop?store=DigiKey&id=547750; Arrow_Electronics-Purchase-URL: https://snapeda.com/shop?store=Arrow+Electronics&id=547750; MP: DRV8871DDA; Texas_Instruments-Purchase-URL: https://snapeda.com/shop?store=Texas+Instruments&id=547750; Availability: Good; Price: None; Value: *; Package: HSOIC-8 Texas Instruments; BuyPart: https://www.snapeda.com/parts/DRV8871DDA/Texas%20Instruments/view-part/547750/?ref=eda

## Nets that join several sheets
+5: MCU (15 pins), Power (6 pins), IO (10 pins)
GND: MCU (23 pins), Power (16 pins), IO (54 pins), Motor (18 pins)
Vload: Power (5 pins), IO (10 pins)
Vmotor: Power (F3.2), IO (J17.1 J18.1), Motor (9 pins)
A4: MCU (U1.33), IO (C16.1 D10.2 Q1.4 R16.2)
A5: MCU (U1.32), IO (C17.1 D11.2 Q2.4 R17.2)
A6: MCU (U1.31), IO (C18.1 D13.2 Q3.4 R20.2)
A7: MCU (U1.30), IO (C19.1 D15.2 Q4.4 R22.2)
B1: MCU (U1.41), Motor (R39.1)
B2: MCU (U1.42), Motor (R40.1)
B3: MCU (U1.43), IO (R46.2)
B4: MCU (U1.44), IO (R45.2)
C2: MCU (U1.21), IO (C25.1 D27.2 Q10.4 R34.2)
C3: MCU (U1.22), IO (C24.1 D25.2 Q9.4 R32.2)
C4: MCU (U1.23), IO (C23.1 D23.2 Q8.4 R30.2)
C5: MCU (U1.24), IO (C22.1 D21.2 Q7.4 R28.2)
C6: MCU (U1.25), IO (C21.1 D19.2 Q6.4 R26.2)
C7: MCU (U1.26), IO (C20.1 D17.2 Q5.4 R24.2)
D4: MCU (U1.13), Motor (R41.1)
D5: MCU (U1.14), Motor (R42.1)
D6: MCU (U1.15), Motor (R43.1)
D7: MCU (U1.16), Motor (R44.1)